# EAGLE design LowLevelv2 (EAGLE 8.0.2)

## Sheet 1 of 2
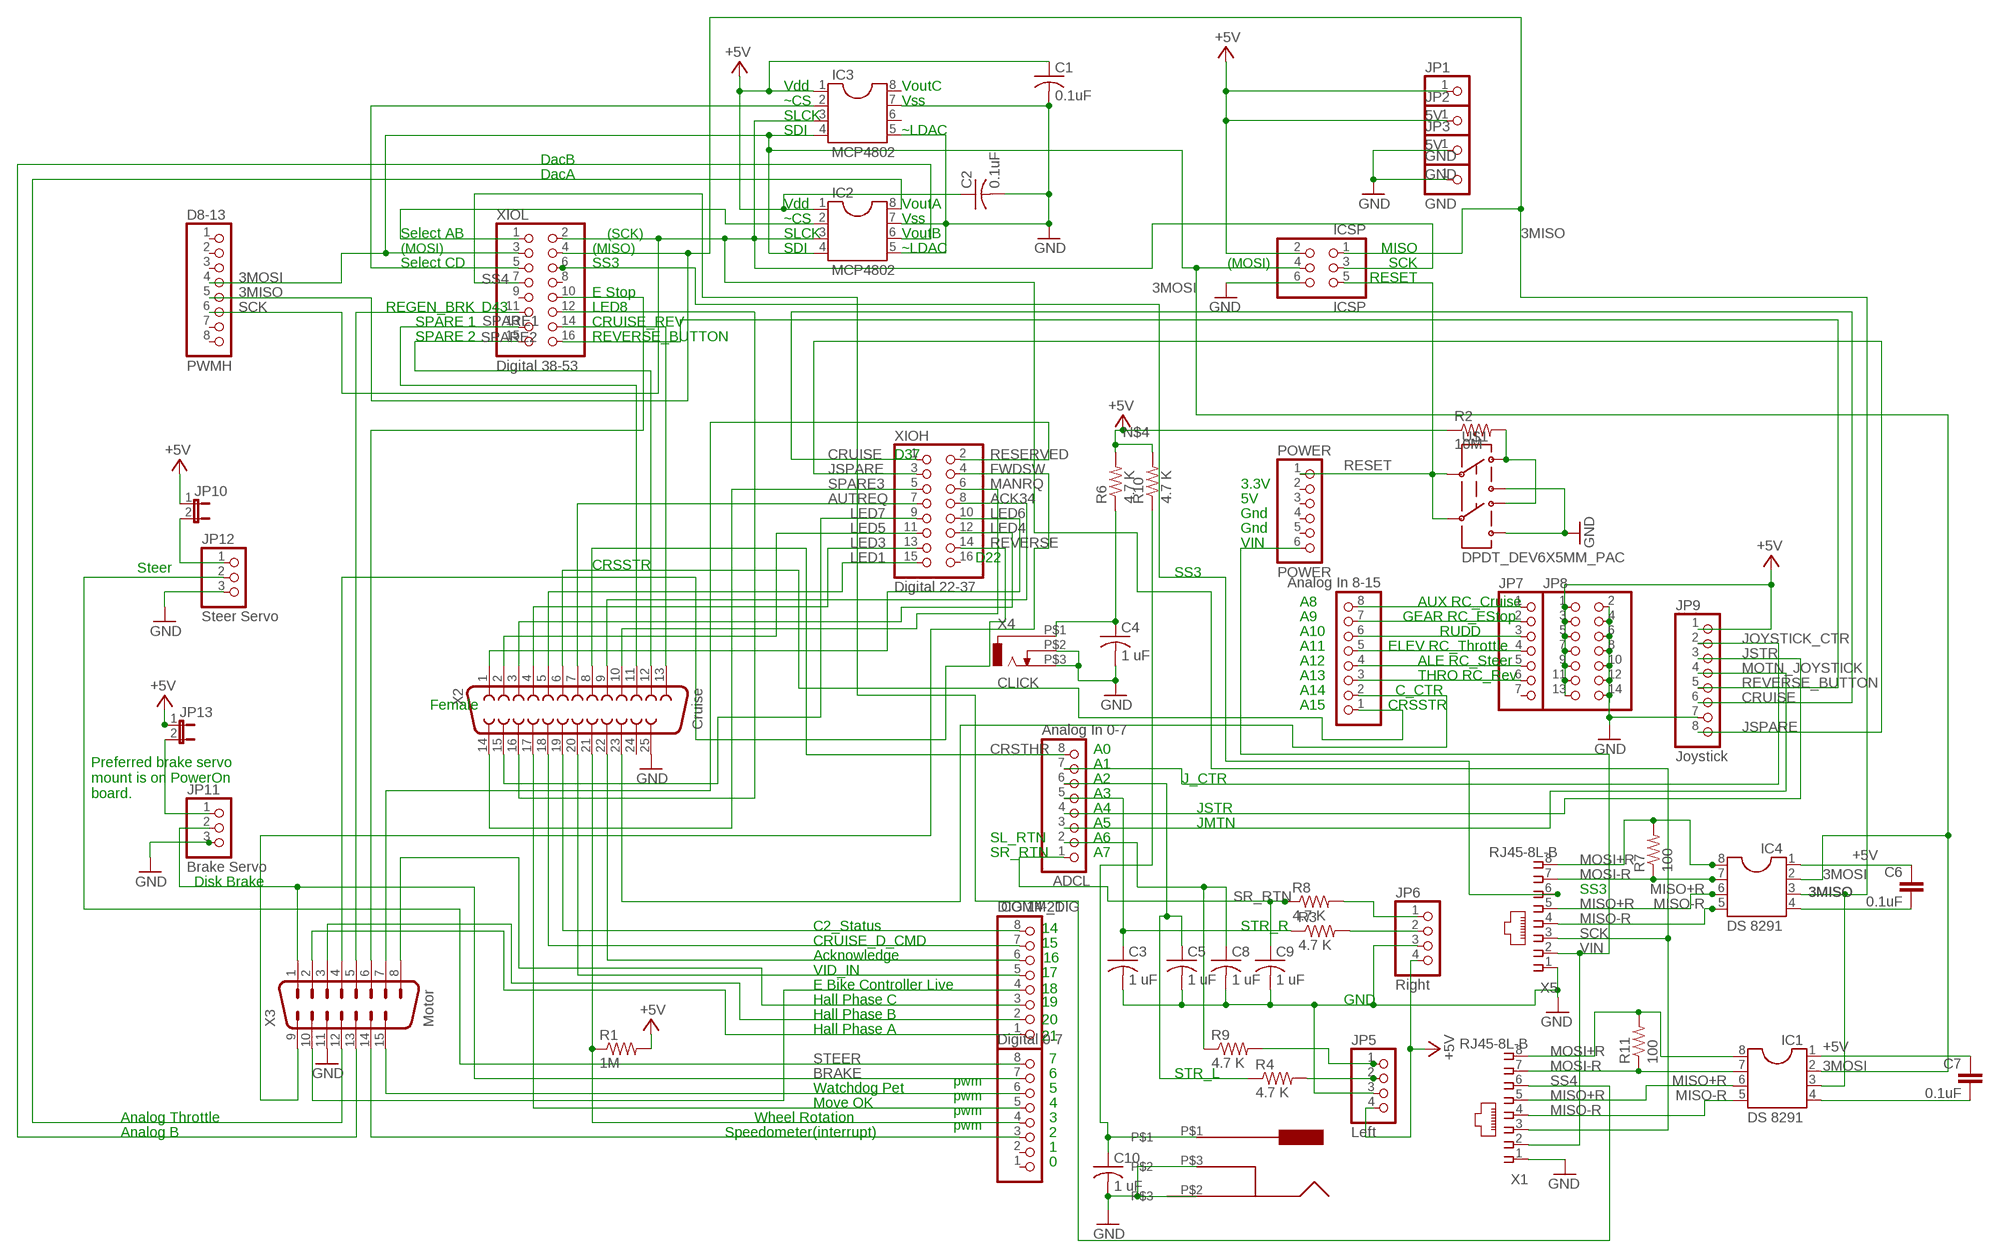
[diagram p0: schematic, sheet 1]

### Parts
ADCH  Analog In 8-15  PINHD-1X8  [1X08]
ADCL  Analog In 0-7  PINHD-1X8  [1X08]
C1  0.1uF  C-US025-025X050  [C025-025X050]
C2  0.1uF  C-US025-025X050  [C025-025X050]
C3  1 uF  C-US025-030X050  [C025-030X050]
C4  1 uF  C-US025-030X050  [C025-030X050]
C5  1 uF  C-US025-030X050  [C025-030X050]
C6  0.1uF  C2.5/2  [C2.5-2]
C7  0.1uF  C2.5/2  [C2.5-2]
C8  1 uF  C-US025-030X050  [C025-030X050]
C9  1 uF  C-US025-030X050  [C025-030X050]
C10  1 uF  C-US025-030X050  [C025-030X050]
COMM_DIG  DIG 14-21  PINHD-1X8  [1X08]
D8-13  PWMH  PINHD-1X8  [1X08]
GND  GND  PINHD-1X1  [1X01]
IC1  DS 8291  DIL8  [DIL08]
IC2  MCP4802  DIL8  [DIL08]
IC3  MCP4802  DIL8  [DIL08]
IC4  DS 8291  DIL8  [DIL08]
ICSP  ICSP  PINHD-2X3  [2X03]
JP1  5V  PINHD-1X1  [1X01]
JP2  5V  PINHD-1X1  [1X01]
JP3  GND  PINHD-1X1  [1X01]
JP5  Left  PINHD-1X4/90  [1X04/90]
JP6  Right  PINHD-1X4/90  [1X04/90]
JP7  PINHD-1X7  [1X07]
JP8  PINHD-2X7  [2X07]
JP9  Joystick  PINHD-1X8/90  [1X08/90]
JP10  JP1E  [JP1]
JP11  Brake Servo  PINHD-1X3/90  [1X03/90]
JP12  Steer Servo  PINHD-1X3/90  [1X03/90]
JP13  JP1E  [JP1]
POWER  POWER  PINHD-1X6  [1X06]
PWML  Digital 0-7  PINHD-1X8  [1X08]
R1  1M  R-US_0207/10  [0207/10]
R2  10M  R-US_0207/10  [0207/10]
R3  4.7 K  R-US_0207/10  [0207/10]
R4  4.7 K  R-US_0207/10  [0207/10]
R6  4.7 K  R-US_0207/10  [0207/10]
R7  100  R-US_0207/10  [0207/10]
R8  4.7 K  R-US_0207/10  [0207/10]
R9  4.7 K  R-US_0207/10  [0207/10]
R10  4.7 K  R-US_0207/10  [0207/10]
R11  100  R-US_0207/10  [0207/10]
U$1  DPDT_DEV6X5MM_PAC  [NEWSWITCH2_PAC]
U$2  CUI_JACKTHROUGH_HOLE  [CUIJACK]
X1  RJ45-8L-B  [RJ45-NO-SHIELD]
X2  Cruise  F25H  [F25H]
X3  Motor  M15-182  [182-015-MALE]
X4  CLICK  ODO_JACK  [ODO_JACK]
X5  RJ45-8L-B  [RJ45-NO-SHIELD]
XIOH  Digital 22-37  PINHD-2X8  [2X08]
XIOL  Digital 38-53  PINHD-2X8  [2X08]

### Nets
1C: ADCH.6 JP7.3
3A: ADCH.3 JP7.6
3MISO: D8-13.5 IC1.3 IC4.3 ICSP.1 XIOL.4
3MOSI: D8-13.4 IC1.2 IC2.4 IC3.4 IC4.2 ICSP.4 XIOL.3
5V: JP10.2 JP12.1
5VOLT: JP11.1 JP13.2
+5V: C1.1 C2.1 C6.1 IC2.1 IC3.1 IC4.1 ICSP.2 JP1.1 JP2.1 JP5.4 JP6.4 JP8.1 JP8.3 JP8.5 JP8.7 JP8.9 JP8.11 JP8.13 JP9.1 JP10.1 JP13.1 R1.2 R2.1 R6.2 R10.2
A14: ADCH.7 JP7.2
A15: ADCH.8 JP7.1
ACK34: X2.9 XIOH.8
ACKNOWLEDGE: COMM_DIG.6 X2.22
AUTREQ: X2.7 XIOH.7
BRAKE: JP11.2 PWML.7 X3.1
C2STATUS: COMM_DIG.8 X2.19
C_CTR: ADCH.2 X2.23
CRSSTR: ADCH.1 X2.6
CRSTHR: ADCL.8 X2.8
CRUISE: JP9.6 XIOH.1
CRUISE_D_CMD: COMM_DIG.7 X2.18
CRUISE_REV: X2.13 XIOL.14
DACA: IC2.8 X3.12
DACB: IC2.6 X3.13
EBIKECONTRL: COMM_DIG.4 X3.10
ESTOP: X3.6 XIOL.10
FWDSW: X3.9 XIOH.4
GND: C1.2 C2.2 C3.2 C4.2 C5.2 C8.2 C9.2 C10.2 GND.1 IC2.5 IC2.7 IC3.5 IC3.7 ICSP.6 JP3.1 JP5.3 JP6.3 JP8.2 JP8.4 JP8.6 JP8.8 JP8.10 JP8.12 JP8.14 JP9.7 JP11.3 JP12.3 U$1.PIN3 U$1.PIN6 U$2.P$2 U$2.P$3 X1.1 X2.25 X3.11 X4.P$2 X4.P$3 X5.1
HALLPHASEA: COMM_DIG.1 X3.2
HALLPHASEB: COMM_DIG.2 X3.3
HALLPHASEC: COMM_DIG.3 X3.8
JOYSTICK_CTR: ADCL.7 JP9.2
JSPARE: JP9.8 XIOH.3
JSTR: ADCL.4 JP9.3
L_STR: JP5.2 R4.2
LED1: X2.5 XIOH.15
LED3: X2.4 XIOH.13
LED4: X2.3 XIOH.12
LED5: X2.2 XIOH.11
LED6: X2.1 XIOH.10
LED7: X2.15 XIOH.9
LED8: X2.16 XIOL.12
MANRQ: X2.10 XIOH.6
MISO+R: IC1.6 IC4.6 X1.5 X5.5
MISO-R: IC1.5 IC4.5 X1.4 X5.4
MOSI+R: IC1.8 IC4.8 R7.2 R11.2 X1.8 X5.8
MOSI-R: IC1.7 IC4.7 R7.1 R11.1 X1.7 X5.7
MOTN_JOYSTICK: ADCL.3 JP9.4
MOVEOK: PWML.5 X2.17
N$1: C10.1 R10.1 U$2.P$1
N$2: C6.2 IC4.4
N$3: C7.2 IC1.4
N$4: C4.1 R6.1 X4.P$1
N$5: C7.1 IC1.1
N$6: R2.2 U$1.PIN1 U$1.PIN4
N$27: ADCH.4 JP7.5
N$28: ADCH.5 JP7.4
R_STR: JP6.2 R3.2
REGENBAKE: X3.5 XIOL.11
RESERVED: X3.7 XIOH.2
RESET: ICSP.5 POWER.1 U$1.PIN2 U$1.PIN5
REVERSE: X3.4 XIOH.14
REVERSE_BUTTON: JP9.5 XIOL.16
SCK: D8-13.6 IC2.3 IC3.3 ICSP.3 X1.3 X5.3 XIOL.2
SELECTAB: IC2.2 XIOL.1
SELECTCD: IC3.2 XIOL.5
SL_RET: JP5.1 R9.2
SL_RTN: ADCL.2 C8.1 R9.1
SPARE1: X2.11 XIOL.13
SPARE2: X2.12 XIOL.15
SPARE3: X2.14 XIOH.5
SPEEDOMETER: PWML.3 X3.14
SR_RET: JP6.1 R8.2
SR_RTN: ADCL.1 C9.1 R8.1
SS3: X5.6 XIOL.6
SS4: X1.6 XIOL.7
STEER: JP12.2 PWML.8
STR_L: ADCL.6 C5.1 R4.1
STR_R: ADCL.5 C3.1 R3.1
VIDIN: COMM_DIG.5 X2.20
VIN: POWER.6 X1.2 X5.2
WATCHDOG: PWML.6 X3.15
WHEELROTATION: PWML.4 R1.1 X2.21
Unconnected: D8-13.1 D8-13.2 D8-13.3 D8-13.7 D8-13.8 IC3.6 IC3.8 JP7.7 POWER.2 POWER.3 POWER.4 POWER.5 PWML.1 PWML.2 X2.24 XIOH.16 XIOL.8 XIOL.9

### Notes on the sheet
- Vdd | VoutC
- ~CS | Vss
- SLCK
- SDI | ~LDAC
- DacB
- DacA
- Vdd | VoutA
- ~CS | Vss
- Select AB | (SCK) | SLCK | VoutB
- (MOSI) | (MISO) | SDI | ~LDAC | MISO
- Select CD | SS3 | (MOSI) | SCK
- RESET
- E Stop
- REGEN_BRK | D43
- SPARE 1
- SPARE 2
- D37
- 3.3V
- 5V
- Gnd
- Gnd
- VIN
- Steer | D22
- CRSSTR
- SS3
- A8 | AUX RC_Cruise
- A9 | GEAR RC_EStop
- A10 | RUDD
- A11 | ELEV RC_Throttle
- A12 | ALE RC_Steer
- A13 | THRO RC_Rev
- A14 | C_CTR
- Female | A15 | CRSSTR
- A0
- A1
- A2 | J_CTR
- Preferred brake servo
  mount is on PowerOn
  board.
- A3
- A4 | JSTR
- A5 | JMTN
- SL_RTN | A6
- SR_RTN | A7
- Disk Brake
- SS3
- C2_Status | 14 | STR_R
- 15
- Acknowledge | 16
- VID_IN | 17
- E Bike Controller Live | 18
- Hall Phase C | 19 | GND
- Hall Phase B
- 20
- Hall Phase A
- 21
- 7
- 6 | STR_L
- pwm
- Watchdog Pet | 5
- pwm
- Move OK | 4
- pwm
- Analog Throttle | Wheel Rotation | 3
- pwm
- Analog B | Speedometer(interrupt) | 2
- 1
- 0

## Sheet 2 of 2

## Library data of the parts
ADCH ADCL COMM_DIG D8-13 JP9 PWML = pinhead:PINHD-1X8: PIN HEADER
C1-C5 C8-C10 = rcl:C-US: CAPACITOR, American symbol
C6 C7 = capacitor-wima:C: CAPACITOR naming: grid - package width
GND JP1-JP3 = pinhead:PINHD-1X1: PIN HEADER
IC1-IC4 = ic-package:DIL8: Dual In Line / Socket
ICSP = pinhead:PINHD-2X3: PIN HEADER
JP5 JP6 = pinhead:PINHD-1X4: PIN HEADER
JP7 = pinhead:PINHD-1X7: PIN HEADER
JP8 = pinhead:PINHD-2X7: PIN HEADER
JP10 JP13 = jumper:JP1E: JUMPER
JP11 JP12 = pinhead:PINHD-1X3: PIN HEADER
POWER = pinhead:PINHD-1X6: PIN HEADER
R1-R4 R6-R11 = rcl:R-US_: RESISTOR, American symbol
U$1 = elcanoParts:DPDT_DEV
U$2 = Elcano:CUI_JACK
X1 X5 = con-tycoelectronics:RJ45: CORCOM Modular RJ Jacks No Shield Source: www.tycoelectronics.com .. ENG_DS_1654001_1099_RJ_L_0507.pdf; MF: TYCO ELECTRONICS; MPN: RJ45-8L-B; OC_FARNELL: 1279843; OC_NEWARK: 52K4445
X2 = con-subd:F25: SUB-D; OC_FARNELL: unknown; OC_NEWARK: unknown
X3 = con-subd:M15: SUB-D; OC_FARNELL: unknown; OC_NEWARK: unknown
X4 = Elcano:ODO_JACK
XIOH XIOL = pinhead:PINHD-2X8: PIN HEADER

## Net classes
0 default: width 0.178 mm, drill 0.305 mm, clearance 0.178 mm
1 Power: width 0.508 mm, drill 0.305 mm, clearance 0.254 mm

## Board
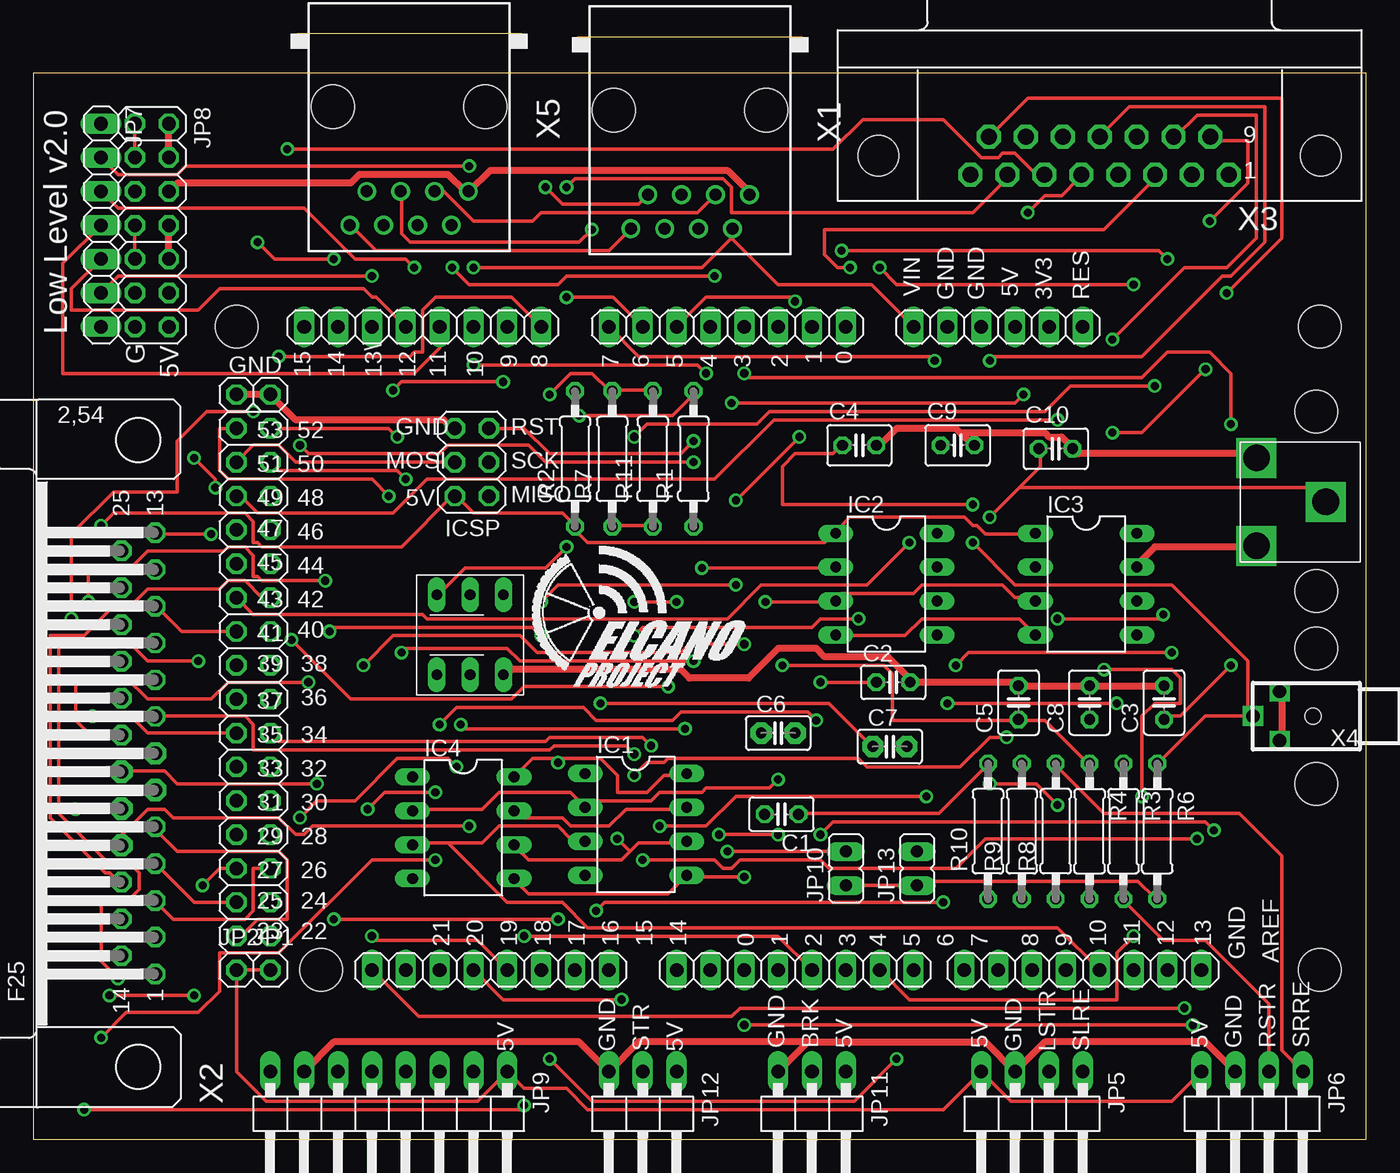
[diagram p1: board, top side]
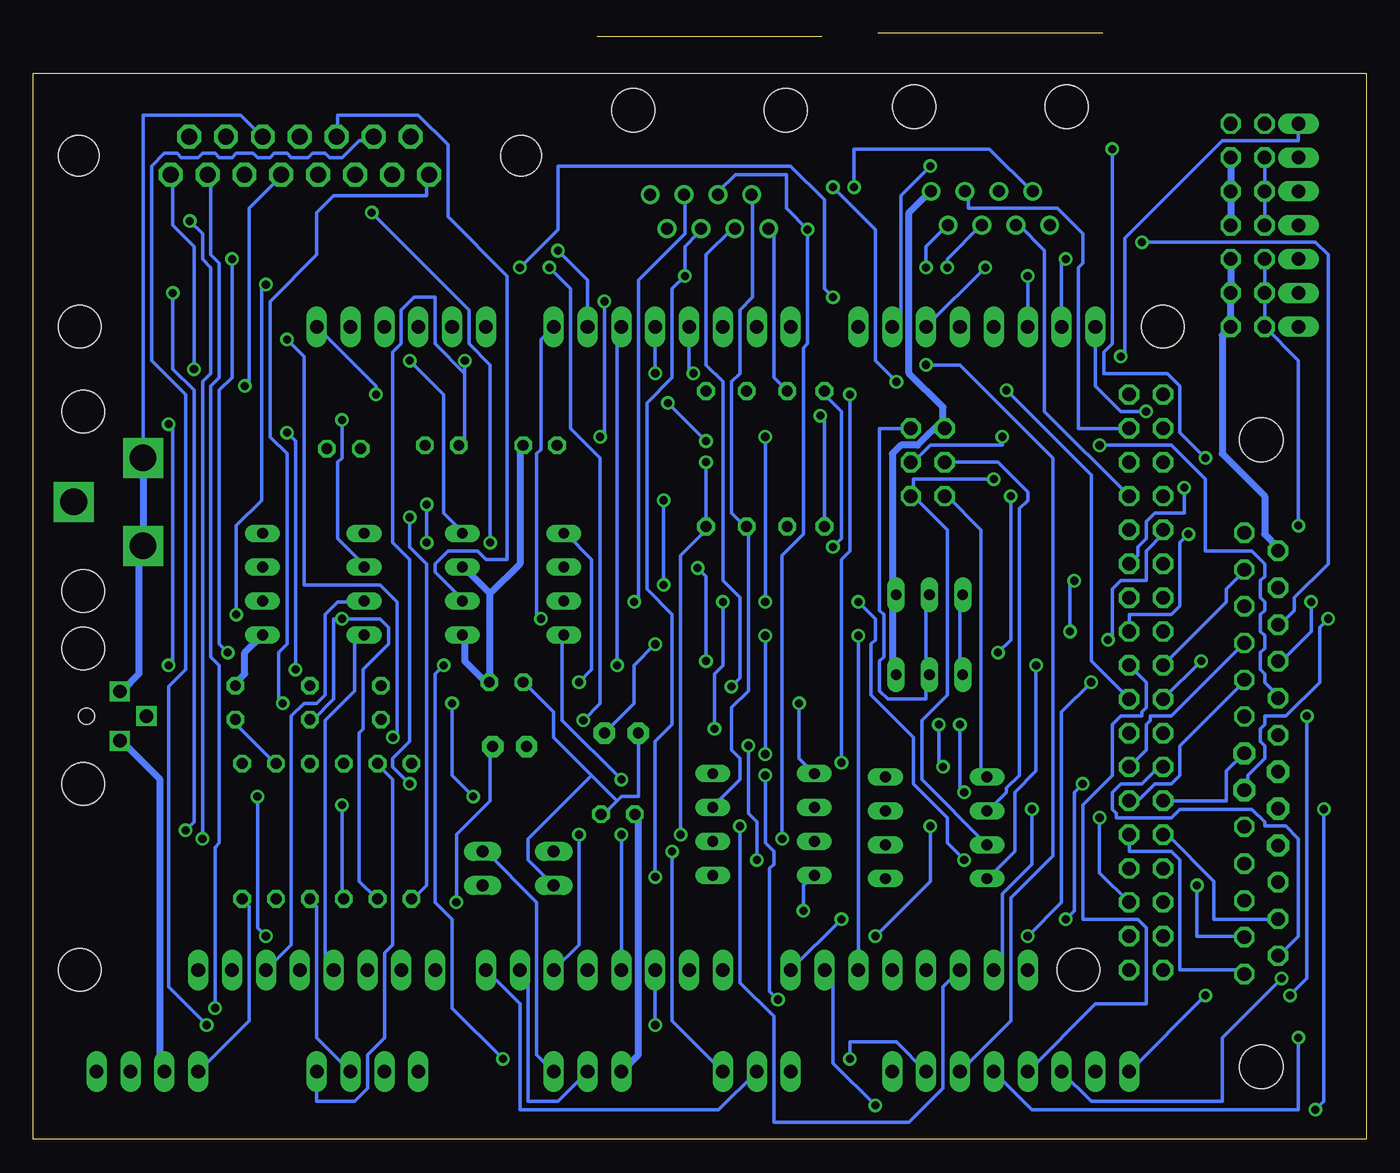
[diagram p2: board, bottom side, seen from below]

Size 100 x 80 mm. Coordinates in mm from the lower left corner, seen from the top.
Outline: 0,0 100,0 100,80 0,80 0,0
Copper layers (1*16): Top 0.035mm / dielectric 1.5mm / Bottom 0.035mm
Design rules "default": minimum track width 10mil, minimum drill 24mil, track to track 8mil, track to pad 8mil, pad to pad 8mil, via to via 8mil, smd to smd 8mil, copper to edge 40mil, drill to drill 8mil, minimum pad ring 10mil, minimum via ring 8mil, stop-mask expansion 4mil, vias tented up to drill 0mil, thermal gap 10mil
Holes 3.2 mm at 96.27,36.83 96.27,26.67 96.27,41.15 96.27,54.61 21.59,12.7 96.52,12.7 15.24,60.96 96.52,60.96

### Footprints (pad centres in the part's own frame; a part is rotated, then mirrored left to right if it is on the bottom)
1X08 = drill 1.016 long: 1 -8.89,0; 2 -6.35,0; 3 -3.81,0; 4 -1.27,0; 5 1.27,0; 6 3.81,0; 7 6.35,0; 8 8.89,0
C025-025X050 = drill 0.813 octagon: 1 -1.27,0; 2 1.27,0
C025-030X050 = drill 0.813 octagon: 1 -1.27,0; 2 1.27,0
C2.5-2 = drill 0.813 pad 1.6 octagon: 1 -1.27,0; 2 1.27,0
1X01 = drill 1.016 octagon: 1 0,0
DIL08 = drill 0.813 long: 1 -3.81,-3.81; 2 -1.27,-3.81; 3 1.27,-3.81; 4 3.81,-3.81; 5 3.81,3.81; 6 1.27,3.81; 7 -1.27,3.81; 8 -3.81,3.81
2X03 = drill 1.016 octagon: 1 -2.54,-1.27; 2 -2.54,1.27; 3 0,-1.27; 4 0,1.27; 5 2.54,-1.27; 6 2.54,1.27
1X04/90 = drill 1.016 long: 1 -3.81,-3.81; 2 -1.27,-3.81; 3 1.27,-3.81; 4 3.81,-3.81
1X07 = drill 1.016 long: 1 -7.62,0; 2 -5.08,0; 3 -2.54,0; 4 0,0; 5 2.54,0; 6 5.08,0; 7 7.62,0
2X07 = drill 1.016 octagon: 1 -7.62,-1.27; 2 -7.62,1.27; 3 -5.08,-1.27; 4 -5.08,1.27; 5 -2.54,-1.27; 6 -2.54,1.27; 7 0,-1.27; 8 0,1.27; 9 2.54,-1.27; 10 2.54,1.27; 11 5.08,-1.27; 12 5.08,1.27; 13 7.62,-1.27; 14 7.62,1.27
1X08/90 = drill 1.016 long: 1 -8.89,-3.81; 2 -6.35,-3.81; 3 -3.81,-3.81; 4 -1.27,-3.81; 5 1.27,-3.81; 6 3.81,-3.81; 7 6.35,-3.81; 8 8.89,-3.81
JP1 = drill 0.914 long: 1 0,-1.27; 2 0,1.27
1X03/90 = drill 1.016 long: 1 -2.54,-3.81; 2 0,-3.81; 3 2.54,-3.81
1X06 = drill 1.016 long: 1 -6.35,0; 2 -3.81,0; 3 -1.27,0; 4 1.27,0; 5 3.81,0; 6 6.35,0
0207/10 = drill 0.813 octagon: 1 -5.08,0; 2 5.08,0
NEWSWITCH2_PAC = drill 0.8 long: PIN1 -2.5,3; PIN2 0,3; PIN3 2.5,3; PIN4 -2.5,-3; PIN5 0,-3; PIN6 2.5,-3
CUIJACK = drill 2 pad 2.184 square: P$1 2.6,4.5; P$2 7.8,1.2; P$3 7.8,7.8
RJ45-NO-SHIELD = drill 0.9 pad 1.4: 1 -4.445,6.35; 2 -3.175,8.89; 3 -1.905,6.35; 4 -0.635,8.89; 5 0.635,6.35; 6 1.905,8.89; 7 3.175,6.35; 8 4.445,8.89 | hole 3.251: -5.715,0; 5.715,0
F25H = drill 1.016 octagon: 1 -16.561,-1.27; 2 -13.792,-1.27; 3 -11.049,-1.27; 4 -8.28,-1.27; 5 -5.512,-1.27; 8 2.769,-1.27; 9 5.512,-1.27; 10 8.28,-1.27; 11 11.049,-1.27; 12 13.792,-1.27; 13 16.561,-1.27; 14 -15.189,1.27; 15 -12.421,1.27; 16 -9.652,1.27; 20 1.372,1.27; 21 4.14,1.27; 22 6.909,1.27; 23 9.652,1.27; 24 12.421,1.27; 25 15.189,1.27 | drill 1.016 pad 1.67 octagon: 6 -2.769,-1.27; 7 0,-1.27; 17 -6.909,1.27; 18 -4.14,1.27; 19 -1.372,1.27 | hole 3.302: -23.52,0; 23.52,0
182-015-MALE = drill 1.194 pad 1.524 octagon: 1 -9.69,10.923; 2 -6.921,10.923; 3 -4.153,10.923; 4 -1.384,10.923; 5 1.384,10.923; 6 4.153,10.923; 7 6.921,10.923; 8 9.69,10.923; 9 -8.306,8.08; 10 -5.537,8.08; 11 -2.769,8.08; 12 0,8.08; 13 2.769,8.08; 14 5.537,8.08; 15 8.306,8.08 | hole 3.048: -16.599,9.501; 16.599,9.501
ODO_JACK = drill 1 square: P$1 4.5,0; P$2 2.5,1.85; P$3 2.5,-1.85 | hole 1.2: 0,0
2X08 = drill 1.016 octagon: 1 -8.89,-1.27; 2 -8.89,1.27; 3 -6.35,-1.27; 4 -6.35,1.27; 5 -3.81,-1.27; 6 -3.81,1.27; 7 -1.27,-1.27; 8 -1.27,1.27; 9 1.27,-1.27; 10 1.27,1.27; 11 3.81,-1.27; 12 3.81,1.27; 13 6.35,-1.27; 14 6.35,1.27; 15 8.89,-1.27; 16 8.89,1.27

### Placement (x,y rotation side)
ADCH  29.21,60.96 0 top
ADCL  52.07,60.96 0 top
C1  56.13,24.38 180 top
C2  64.52,34.29 0 top
C3  84.84,32.77 90 top
C4  61.98,52.07 0 top
C5  73.91,32.77 90 top
C6  55.88,30.48 0 top
C7  64.26,29.46 0 top
C8  79.25,32.77 90 top
C9  69.34,52.07 0 top
C10  76.71,51.82 0 top
COMM_DIG  34.29,12.7 0 top
D8-13  78.74,12.7 0 top
GND  15.24,55.88 0 top
IC1  45.21,23.62 270 top
IC2  64.01,41.66 270 top
IC3  78.99,41.66 270 top
IC4  32.26,23.37 270 top
ICSP  32.89,50.8 90 top
JP1  17.78,12.7 0 top
JP2  15.24,12.7 0 top
JP3  17.78,55.88 0 top
JP5  74.93,1.27 180 top
JP6  91.44,1.27 180 top
JP7  5.08,68.58 270 top
JP8  8.89,68.58 270 top
JP9  26.67,1.27 180 top
JP10  60.96,20.32 0 top
JP11  58.42,1.27 180 top
JP12  45.72,1.27 180 top
JP13  66.29,20.32 0 top
POWER  72.39,60.96 180 top
PWML  57.15,12.7 0 top
R1  49.53,51.05 90 top
R2  40.64,51.05 90 top
R3  81.79,23.11 270 top
R4  79.25,23.11 270 top
R6  84.33,23.11 270 top
R7  43.43,51.05 90 top
R8  76.71,23.11 90 top
R9  74.17,23.11 90 top
R10  71.63,23.11 90 top
R11  46.48,51.05 90 top
U$1  32.77,37.85 0 top
U$2  99.57,52.32 180 top
X1  49.28,77.22 180 top
X2  7.87,28.96 90 top
X3  80.01,83.31 180 top
X4  96.01,31.75 180 top
X5  28.19,77.47 180 top
XIOH  16.51,24.13 270 top
XIOL  16.51,44.45 270 top

### Tracks (layer width: path | path; a pad name or v marks a point on that pad's centre or on a via)
1C  (via drill 0.61)
  Top 0.254: v28.57,65.41 27.94,66.04 24.13,66.04 20.32,69.85 6.35,69.85 JP7.3
  Bottom 0.254: v28.57,65.41 ADCH.6
3A  (via drill 0.61)
  Top 0.254: JP7.6 6.35,64.77 v25.4,64.77
  Bottom 0.254: ADCH.3 v25.4,64.77
3MISO  (via drill 0.61)
  Top 0.254: 31.11,22.23 33.66,22.23 34.92,23.5 39.37,23.5 40.32,22.54 41.27,22.54 IC1.3 | 31.11,22.23 28.57,22.23 IC4.3 | D8-13.5 76.83,15.88 41.59,15.88 39.69,17.78 35.56,17.78 31.11,22.23 | XIOL.4 18.41,50.16 27.3,50.16 v27.94,49.53
  Bottom 0.254: 33.97,48.26 31.43,45.72 31.43,33.34 33.34,31.43 33.34,26.99 IC4.3 | v27.94,49.53 33.97,49.53 33.97,48.26 | 33.97,48.26 ICSP.1
3MOSI  (via drill 0.61)
  Top 0.254: IC3.4 73.98,39.05 66.67,39.05 65.41,37.78 60.33,37.78 IC2.4 | 40.96,25.4 41.27,25.08 IC1.2 40.96,25.4 | 40.96,25.4 40.32,26.04 34.92,26.04 33.66,24.77 28.57,24.77 IC4.2 | XIOL.3 16.51,52.07 18.41,52.07 19.68,50.8 ICSP.4 | v55.88,26.99 55.24,26.35 50.48,26.35 50.16,26.04 46.99,26.04 46.35,25.4 40.96,25.4
  Bottom 0.254: D8-13.4 78.11,13.34 78.11,31.43 75.88,33.66 75.88,37.15 IC3.4 | ICSP.4 27.62,50.8 25.4,48.58 25.4,47.94 26.04,47.31 26.04,27.3 26.99,26.35 26.99,26.04 28.26,24.77 IC4.2 | v55.88,26.99 60.33,31.43 60.33,37.78 IC2.4
5V  (via drill 0.61)
  Top 0.254: v52.07,21.59 JP10.2
  Bottom 0.254: v52.07,21.59 52.07,8.89 JP12.1
5VOLT
  Bottom 0.254: JP11.1 62.23,6.35 62.23,17.78 66.04,21.59 JP13.2
+5V  (via drill 0.61)
  Top 0.254: JP10.1 JP13.1 66.36,19.05 66.67,19.37 82.87,19.37 84.14,18.1 R6.2 | R10.2 71.44,27.94 67.94,24.45 57.47,24.45 C1.1 | JP1.1 JP2.1 15.24,5.08 17.46,2.86 33.34,2.86 JP9.1 36.83,3.81 40.01,3.81 41.59,2.22 68.26,2.22 JP5.4 73.34,2.86 85.41,2.86 JP6.4 | JP8.3 JP8.1 | JP8.7 JP8.9 | IC3.1 74.93,45.4 71.44,45.4 70.8,46.04 70.48,46.04 69.85,46.67 61.28,46.67 60.33,45.72 IC2.1 60.01,45.4 59.37,44.77 41.59,44.77 40.64,45.72 R2.1 40.64,46.04 39.69,46.99 33.02,46.99 31.75,48.26 ICSP.2 31.43,48.26 27.62,44.45 17.14,44.45 16.83,44.77 16.51,44.77 16.51,46.35 15.88,46.99 6.03,46.99 v5.08,46.04 | v40.96,54.29 47.94,54.29 49.53,55.88 R1.2 | v59.05,34.29 C2.1
  Bottom 0.254: 56.2,25.4 55.88,25.72 54.61,25.72 C6.1 | 56.2,25.4 57.15,24.45 C1.1 | 56.2,25.4 58.1,27.3 | 58.1,27.3 60.96,30.16 60.96,32.07 63.18,34.29 C2.1 | JP10.1 62.87,20.95 62.87,22.54 58.1,27.3 | JP6.4 83.82,8.89 83.82,17.46 84.14,17.78 R6.2 | JP8.3 JP8.5 JP8.7 | JP8.9 JP8.11 JP8.13 5.08,58.42 v5.08,46.04 | IC4.1 28.89,27.62 28.89,45.72 31.43,48.26 ICSP.2 | v40.96,54.29 40.64,53.98 R2.1 | v59.05,34.29 58.1,35.24 58.1,43.5 60.01,45.4 IC2.1
A14  (via drill 0.61)
  Top 0.254: v32.7,73.03 11.43,73.03 10.79,72.39 6.35,72.39 JP7.2
  Bottom 0.254: ADCH.7 34.92,61.59 34.92,70.8 v32.7,73.03
A15  (via drill 0.61)
  Top 0.254: ADCH.8 35.88,63.18 30.16,63.18 29.21,62.23 29.21,59.05 28.57,59.05 28.26,58.74 v18.41,58.74
  Bottom 0.254: v18.41,58.74 18.1,59.05 18.1,67.63 10.79,74.93 5.08,74.93 JP7.1
ACK34
  Bottom 0.254: XIOH.8 17.14,25.4 15.88,26.67 14.61,26.67 13.97,27.3 13.97,29.53 9.21,34.29 X2.9
ACKNOWLEDGE  (via drill 0.61)
  Top 0.254: v4.13,40.32 4.13,42.86 7.3,42.86 8.57,44.13 14.29,44.13 14.61,44.45 15.88,44.45 16.51,43.81 16.51,42.23 16.83,42.23 17.14,41.91 v21.91,41.91 | v22.23,38.1 22.54,38.42 37.47,38.42 v38.1,37.78
  Bottom 0.254: v4.13,40.32 4.13,38.1 6.35,35.88 X2.22 | v21.91,41.91 22.23,41.59 v22.23,38.1 | COMM_DIG.6 v38.1,37.78
AUTREQ
  Bottom 0.254: XIOH.7 10.48,25.4 10.48,27.62 X2.7
BRAKE  (via drill 0.61)
  Top 0.254: v87.95,57.78 83.19,53.02 v80.96,53.02 | v80.33,35.24 85.41,35.24 86.04,34.61 86.04,32.7 84.14,32.7 83.19,31.75 v83.19,25.72 | v82.55,15.24 81.28,13.97 81.28,10.48 65.72,10.48 PWML.7
  Bottom 0.254: JP11.2 60.64,2.86 62.87,2.86 62.87,12.06 PWML.7 | v87.95,57.78 87.95,66.99 89.53,68.58 89.53,72.07 X3.1 | v80.96,53.02 80.33,52.39 v80.33,35.24 | v83.19,25.72 83.19,15.88 v82.55,15.24
C2STATUS  (via drill 0.61)
  Top 0.254: v22.54,16.51 v39.37,16.51 | v21.27,26.67 10.79,26.67 9.84,27.62 6.67,27.62 X2.19
  Bottom 0.254: v39.37,16.51 COMM_DIG.8 | v22.54,16.51 21.91,17.14 21.91,26.04 v21.27,26.67
C_CTR  (via drill 0.61)
  Top 0.254: v16.83,67.31 18.1,66.04 v22.54,66.04
  Bottom 0.254: v16.83,67.31 3.81,67.31 2.86,66.36 2.86,43.18 5.4,40.64 5.4,39.69 6.35,38.73 X2.23 | v22.54,66.04 22.86,65.72 ADCH.2
CRSSTR  (via drill 0.61)
  Top 0.254: v16.51,54.61 13.02,54.61 10.79,52.39 10.79,48.58 6.03,48.58 2.86,45.4 v2.86,39.05
  Bottom 0.254: ADCH.1 20.32,56.52 18.41,54.61 v16.51,54.61 | v2.86,39.05 3.49,38.42 3.49,34.29 6.03,31.75 7.62,31.75 7.62,31.11 7.94,30.8 7.94,29.84 7.62,29.53 7.62,28.57 8.89,27.3 8.89,26.35 X2.6
CRSTHR  (via drill 0.61)
  Top 0.254: v45.09,28.89 44.45,29.53 39.05,29.53 38.73,29.21 16.51,29.21 16.51,31.11 15.88,31.75 9.21,31.75 X2.8 | v45.09,37.78 45.72,38.42 58.42,38.42 59.05,39.05 v61.91,39.05
  Bottom 0.254: v45.09,37.78 v45.09,28.89 | v61.91,39.05 62.23,39.37 62.23,51.44 61.91,51.75 61.91,60.01 ADCL.8
CRUISE  (via drill 0.61)
  Top 0.254: v6.35,12.06 5.08,13.34 5.08,17.78 6.99,17.78 7.94,18.73 7.94,20 7.3,20.64 5.71,20.64 1.91,24.45 1.91,37.15 7.3,37.15 8.57,35.88 v12.38,35.88
  Bottom 0.254: JP9.6 20.64,2.86 10.79,2.86 10.79,7.62 v6.35,12.06 | XIOH.1 v12.38,35.88
CRUISE_D_CMD  (via drill 0.61)
  Top 0.254: v36.83,2.54 36.51,2.22 v3.81,2.22 | v3.17,24.77 6.35,24.77 X2.18
  Bottom 0.254: COMM_DIG.7 40.01,12.06 40.01,5.71 v36.83,2.54 | v3.81,2.22 3.17,2.86 v3.17,24.77
CRUISE_REV  (via drill 0.61)
  Top 0.254: v13.34,45.4 9.21,45.4 X2.13
  Bottom 0.254: v13.34,45.4 13.97,44.77 13.97,40.01 14.61,39.37 17.78,39.37 XIOL.14
DACA  (via drill 0.61)
  Top 0.254: v71.75,58.42 72.07,58.74 83.19,58.74 89.22,64.77 89.85,64.77 92.39,67.31 92.39,77.47 82.23,77.47 80.01,75.25 X3.12
  Bottom 0.254: v71.75,58.42 69.22,55.88 69.22,46.99 67.94,45.72 IC2.8
DACB
  Bottom 0.254: IC2.6 67.94,40.64 69.85,42.55 69.85,43.18 68.9,44.13 66.67,44.13 66.04,43.5 64.45,43.5 64.45,64.77 68.9,69.22 68.9,74.61 71.12,76.83 77.15,76.83 77.15,75.25 X3.13
EBIKECONTRL  (via drill 0.61)
  Top 0.254: COMM_DIG.4 35.24,10.48 v44.13,10.48 | v45.09,27.3 46.04,28.26 47.31,28.26 47.62,28.57 61.91,28.57 62.55,27.94 69.53,27.94 71.75,30.16 v73.03,30.16 | v80.96,60.01 86.36,65.41 89.53,65.41 91.76,67.63 91.76,76.83 87.31,76.83 85.72,75.25 X3.10
  Bottom 0.254: v44.13,10.48 44.77,11.11 44.77,20.32 44.45,20.64 44.45,21.59 45.09,22.23 v45.09,27.3 | v73.03,30.16 72.71,30.48 72.71,40.32 73.98,41.59 79.69,41.59 79.69,58.74 v80.96,60.01
ESTOP  (via drill 0.61)
  Top 0.254: v13.65,48.9 13.65,49.53 v12.06,51.12 | v19.05,74.3 60.01,74.3 62.23,76.52 68.26,76.52 71.12,73.66 72.39,73.66 72.71,73.98 73.66,73.98 75.25,72.39 75.56,72.39 X3.6
  Bottom 0.254: XIOL.10 17.14,43.81 17.14,44.45 16.51,45.09 16.51,46.35 15.88,46.99 13.65,46.99 v13.65,48.9 | v12.06,51.12 13.97,53.02 13.97,56.52 14.92,57.47 19.68,57.47 19.68,59.05 19.05,59.69 v19.05,74.3
FWDSW  (via drill 0.61)
  Top 0.254: XIOH.4 18.41,29.84 38.42,29.84 38.73,30.16 45.72,30.16 v46.35,29.53 | v45.72,20.95 51.12,20.95 51.75,20.32 52.39,20.32 53.02,20.95 59.05,20.95 59.69,20.32 69.22,20.32 71.44,22.54 v87.31,22.54 | v88.27,68.9 91.12,71.75 91.12,74.93 88.58,74.93 X3.9
  Bottom 0.254: v46.35,29.53 46.35,24.45 45.72,23.81 v45.72,20.95 | v87.31,22.54 87.31,56.83 86.68,57.47 86.68,65.41 87.31,66.04 87.31,67.94 v88.27,68.9
GND
  Top 0.254: 91.76,44.45 U$2.P$3 | 78.11,51.75 C10.2 | 91.76,51.44 U$2.P$2
  Top 0.508: JP8.10 JP8.8 | JP8.4 JP8.2 | GND.1 JP3.1 19.68,53.98 30.8,53.98 31.43,53.34 ICSP.6 | X1.1 53.66,71.12 52.07,72.71 34.29,72.71 32.7,71.12 X5.1 32.38,71.12 31.11,72.39 24.45,72.39 23.81,71.75 10.79,71.75 JP8.6 | X4.P$2 93.66,30.16 93.66,33.34 X4.P$3 | 91.76,44.45 84.14,44.45 82.87,43.18 IC3.7 | C3.2 84.77,33.97 79.38,33.97 C8.2 79.06,33.97 73.98,33.97 C5.2 73.66,34.29 66.04,34.29 | 69.53,53.02 70.48,52.07 C9.2 | 69.53,53.02 69.22,53.34 64.77,53.34 63.5,52.07 C4.2 | 69.53,53.02 75.88,53.02 76.2,52.7 77.15,52.7 77.79,52.07 C10.2 | 78.11,51.75 78.42,51.44 91.76,51.44 | JP9.7 22.54,7.3 40.96,7.3 JP12.3 45.4,7.3 58.1,7.3 | JP6.3 87.95,7.3 75.88,7.3 JP5.3 71.44,7.3 58.1,7.3 | JP11.3 58.1,7.3 | 66.04,34.29 64.14,36.2 59.37,36.2 58.74,36.83 55.88,36.83 53.66,34.61 49.21,34.61 48.58,35.24 35.88,35.24 35.56,34.92 U$1.PIN6 | 66.04,34.29 C2.2
  Bottom 0.254: 32.7,71.12 X5.1 | X3.11 82.87,75.25 84.45,76.83 91.76,76.83 91.76,51.44 U$2.P$2 91.76,51.12
  Bottom 0.508: JP8.10 JP8.12 JP8.14 10.79,60.33 10.79,51.44 7.62,48.26 7.62,45.4 6.67,44.45 X2.25 | JP8.4 JP8.6 JP8.8 | U$1.PIN6 35.56,34.92 35.56,40.64 U$1.PIN3 35.56,40.96 35.56,51.44 34.92,52.07 33.66,52.07 31.75,53.98 | 32.7,71.12 34.29,69.53 34.29,57.47 31.75,54.93 31.75,53.98 | 31.75,53.98 31.75,53.34 ICSP.6 31.75,53.98 | X4.P$3 93.34,33.66 92.08,34.92 92.08,44.45 U$2.P$3 91.76,44.77 91.76,51.12 | IC2.5 67.63,37.78 67.63,35.88 66.04,34.29 C2.2 65.72,34.29 65.72,40.96 | 65.72,40.96 67.63,42.86 IC2.7 | IC3.5 84.14,36.51 84.14,34.92 84.77,34.29 C3.2 | 65.72,40.96 63.5,43.18 63.5,52.07 C4.2 | JP11.3 54.61,6.35 54.61,24.13 C1.2 | JP6.3 90.49,5.4 90.49,26.99 93.34,29.84 X4.P$2
HALLPHASEA  (via drill 0.61)
  Top 0.254: COMM_DIG.1 28.89,9.21 52.39,9.21 53.02,9.84 v86.36,9.84
  Bottom 0.254: v86.36,9.84 86.36,21.91 86.04,22.23 86.04,35.56 86.68,36.2 86.68,56.52 86.04,57.15 86.04,65.72 86.68,66.36 86.68,72.07 X3.2
HALLPHASEB  (via drill 0.61)
  Top 0.254: v25.08,24.77 26.35,26.04 v30.16,26.04 | v30.48,31.11 31.75,32.38 41.27,32.38 42.23,31.43 47.94,31.43 48.58,32.07 58.1,32.07 v58.74,31.43 | v61.28,65.41 60.33,65.41 59.37,66.36 59.37,68.26 80.33,68.26 84.14,72.07 X3.3
  Bottom 0.254: COMM_DIG.2 27.3,13.34 27.3,18.41 25.08,20.64 v25.08,24.77 | v30.16,26.04 30.48,26.35 v30.48,31.11 | v58.74,31.43 57.47,32.7 57.47,51.12 59.69,53.34 59.69,63.82 v61.28,65.41
HALLPHASEC  (via drill 0.61)
  Top 0.254: v46.99,23.5 50.48,23.5 52.7,25.72 v66.99,25.72 | v81.28,32.7 v68.58,32.7
  Bottom 0.254: COMM_DIG.3 31.75,11.43 31.75,3.81 34.29,1.27 44.45,1.27 44.45,9.21 46.99,11.75 v46.99,23.5 | v66.99,25.72 68.58,27.3 v68.58,32.7 | v81.28,32.7 81.6,33.02 81.6,36.51 80.96,37.15 80.96,51.44 82.23,52.7 82.23,62.87 78.74,66.36 78.74,69.53 77.47,70.8 70.48,70.8 70.48,72.07 X3.8
JOYSTICK_CTR  (via drill 0.61)
  Top 0.254: v38.73,6.03 41.91,2.86 61.59,2.86 v64.77,6.03 | v69.22,35.56 70.17,36.51 v85.41,36.51 | v85.09,66.04 84.45,66.67 v60.64,66.67
  Bottom 0.254: JP9.2 35.24,7.3 38.73,7.3 v38.73,6.03 | v64.77,6.03 68.58,9.84 68.58,16.51 69.85,17.78 69.85,34.92 v69.22,35.56 | v85.41,36.51 86.04,37.15 86.04,56.2 85.09,57.15 v85.09,66.04 | v60.64,66.67 58.42,64.45 ADCL.7
JSPARE  (via drill 0.61)
  Top 0.254: v5.71,10.79 v12.06,10.79 | v4.45,31.75 7.3,31.75 8.57,30.48 XIOH.3
  Bottom 0.254: v12.06,10.79 JP9.8 | v5.71,10.79 4.45,12.06 v4.45,31.75
JSTR  (via drill 0.61)
  Top 0.254: v33.02,58.1 49.85,58.1 v50.48,57.47
  Bottom 0.254: JP9.3 26.67,8.89 26.67,18.1 23.5,21.27 23.5,51.12 30.48,58.1 v33.02,58.1 | v50.48,57.47 50.8,57.78 ADCL.4
L_STR
  Bottom 0.254: JP5.2 78.74,7.62 78.74,17.46 79.06,17.78 R4.2
LED1
  Top 0.254: XIOH.15 15.56,15.24 16.83,16.51 19.05,16.51 19.05,20.95 18.41,21.59 10.79,21.59 9.21,23.18 X2.5
LED3
  Top 0.254: XIOH.13 12.06,17.78 9.21,20.64 X2.4
LED4
  Top 0.254: XIOH.12 16.51,20.32 16.51,17.14 15.88,16.51 10.48,16.51 9.21,17.78 X2.3
LED5  (via drill 0.61)
  Top 0.254: v12.7,19.05 13.97,20.32 XIOH.11
  Bottom 0.254: v12.7,19.05 12.7,15.24 9.21,15.24 X2.2
LED6
  Bottom 0.254: XIOH.10 17.78,21.59 14.61,21.59 13.97,20.95 13.97,12.7 9.21,12.7 X2.1
LED7
  Bottom 0.254: XIOH.9 14.92,22.86 11.43,19.37 11.43,16.51 6.67,16.51 X2.15
LED8
  Top 0.254: XIOL.12 17.14,40.64 15.88,41.91 14.61,41.91 13.97,41.27 8.57,41.27 7.3,40.01 6.03,40.01 3.81,37.78 1.27,37.78 1.27,24.13 5.4,20 5.71,20 6.35,19.37 X2.16
MANRQ
  Bottom 0.254: XIOH.6 16.51,29.21 16.51,31.11 16.19,31.43 16.19,31.75 14.61,31.75 9.21,37.15 X2.10
MISO+R  (via drill 0.61)
  Top 0.254: 44.77,21.59 45.4,22.23 48.9,22.23 IC1.6 | 44.77,21.59 44.13,20.95 37.15,20.95 36.2,21.91 IC4.6 | v41.91,68.26 40.96,67.31 28.26,67.31 27.62,67.94 27.62,71.12 X5.5 | v43.81,22.54 44.77,21.59
  Bottom 0.254: X1.5 48.58,71.12 47.31,72.39 43.5,72.39 43.5,69.85 v41.91,68.26 41.91,59.69 42.23,59.37 42.23,45.4 43.81,43.81 v43.81,22.54
MISO-R  (via drill 0.61)
  Top 0.254: IC4.5 36.2,19.37 37.15,18.41 47.62,18.41 IC1.5 49.21,19.68 v53.34,19.68 | v31.43,65.41 32.7,64.14 39.37,64.14 40.01,64.77 v51.12,64.77
  Bottom 0.254: v31.43,65.41 31.43,66.04 28.89,68.58 X5.4 | X1.4 50.16,68.26 50.16,67.94 51.12,66.99 v51.12,64.77 52.07,63.82 52.07,57.15 53.98,55.24 53.98,41.27 52.07,39.37 52.07,31.11 53.34,29.84 v53.34,19.68
MOSI+R  (via drill 0.61)
  Top 0.254: IC4.8 37.47,28.57 39.37,28.57 | 39.37,28.57 42.55,28.57 43.81,27.3 43.81,26.04 46.04,26.04 47.31,27.3 48.9,27.3 IC1.8 | R11.2 46.35,56.2 43.5,56.2 R7.2 43.18,56.2 41.91,57.47 40.32,57.47 v38.73,55.88 | X1.8 43.18,66.67 25.72,66.67 23.81,68.58 X5.8 | v39.37,28.26 39.37,28.57
  Bottom 0.254: X1.8 44.45,67.94 44.45,57.15 R7.2 | v39.37,28.26 39.37,43.5 38.73,44.13 v38.73,55.88
MOSI-R  (via drill 0.61)
  Top 0.254: IC4.7 36.2,24.45 36.51,24.13 39.69,24.13 40.32,23.5 43.18,23.5 44.45,24.77 48.9,24.77 IC1.7 | R7.1 43.5,46.04 46.35,46.04 R11.1 | v38.42,71.44 39.69,70.17 45.4,70.17 X1.7
  Bottom 0.254: X1.7 46.04,70.8 46.04,63.18 46.99,62.23 46.99,57.47 47.62,56.83 47.62,46.99 46.67,46.04 R11.1 46.35,45.72 46.35,33.66 47.62,32.38 47.62,29.21 46.99,28.57 46.99,26.99 48.9,25.08 IC1.7 | v38.42,71.44 38.42,74.3 28.26,74.3 25.08,71.12 X5.7
MOTN_JOYSTICK  (via drill 0.61)
  Top 0.254: v5.08,7.62 6.99,9.53 12.38,9.53 13.97,11.11 13.97,13.97 18.41,13.97 25.4,20.95 v30.16,20.95 | v38.1,40.32 39.37,41.59 v52.7,41.59 | v57.47,52.7 v52.7,47.94 | v57.15,62.87 56.83,63.18 50.48,63.18 ADCL.3
  Bottom 0.254: JP9.4 25.08,2.22 5.08,2.22 v5.08,7.62 | v30.16,20.95 31.43,22.23 31.43,24.13 33.97,26.67 33.97,30.16 37.15,33.34 37.15,37.15 36.83,37.47 36.83,39.05 v38.1,40.32 | v52.7,47.94 v52.7,41.59 | v57.47,52.7 57.15,53.02 v57.15,62.87
MOVEOK  (via drill 0.61)
  Top 0.254: PWML.5 55.88,15.24 v36.83,15.24 | v32.7,23.5 20.95,23.5 20.32,22.86 19.68,22.86 18.41,24.13 10.48,24.13 9.84,24.77 8.57,24.77 6.67,22.86 6.67,22.23 X2.17
  Bottom 0.254: v36.83,15.24 32.7,19.37 v32.7,23.5
N$1  (via drill 0.61)
  Top 0.254: 73.98,48.9 75.56,50.48 75.56,51.75 C10.1 | 73.98,48.9 v71.75,46.67 | 73.98,48.9 95.89,48.9 96.84,47.94 U$2.P$1
  Bottom 0.254: v71.75,46.67 71.75,44.45 70.48,43.18 70.48,19.05 71.44,18.1 R10.1
N$2  (via drill 0.61)
  Top 0.254: v24.77,35.56 26.99,37.78 36.51,37.78 37.78,36.51 48.58,36.51 49.21,37.15 v53.34,37.15
  Bottom 0.254: v24.77,35.56 24.77,27.62 26.35,26.04 26.35,21.59 28.26,19.68 IC4.4 | v53.34,37.15 54.93,35.56 54.93,32.7 C6.2
N$3  (via drill 0.61)
  Top 0.254: v42.23,17.14 42.86,17.78 v68.26,17.78
  Bottom 0.254: v42.23,17.14 42.23,19.05 41.59,19.68 IC1.4 | v68.26,17.78 68.26,22.86 65.72,25.4 65.72,29.21 C7.2
N$4  (via drill 0.61)
  Top 0.254: X4.P$1 91.12,31.75 | 91.12,31.75 87.95,31.75 84.45,28.26 R6.1 | v70.48,47.62 56.2,47.62 56.2,50.48 57.15,51.44 60.01,51.44 60.64,52.07 C4.1 | v70.48,44.77 73.66,41.59 85.41,41.59 91.12,35.88 91.12,31.75
  Bottom 0.254: v70.48,44.77 v70.48,47.62
N$5  (via drill 0.61)
  Top 0.254: v42.55,32.7 59.69,32.7 62.87,29.53 C7.1
  Bottom 0.254: IC1.1 42.55,28.57 v42.55,32.7
N$6  (via drill 0.61)
  Top 0.254: v40.01,44.45 38.42,42.86 32.38,42.86 30.48,40.96 U$1.PIN1
  Bottom 0.254: U$1.PIN4 30.48,34.92 30.48,40.64 U$1.PIN1 | v40.01,44.45 39.37,45.09 39.37,54.61 40.64,55.88 R2.2
N$27
  Top 0.254: JP7.5 2.86,63.82 2.86,62.23 12.38,62.23 13.97,63.82 24.77,63.82 25.4,63.18 25.72,63.18 ADCH.4
N$28
  Top 0.254: JP7.4 2.22,65.72 2.22,57.47 28.57,57.47 30.48,59.37 ADCH.5
R_STR
  Top 0.254: JP6.2 92.71,10.16 87.95,14.92 84.77,14.92 81.92,17.78 R3.2
REGENBAKE  (via drill 0.61)
  Top 0.254: XIOL.11 16.51,39.37 29.21,39.37 29.53,39.05 52.07,39.05 54.61,41.59 62.55,41.59 v65.72,44.77 | v74.61,69.53 75.88,70.8 77.15,70.8 78.42,72.07 X3.5
  Bottom 0.254: v65.72,44.77 65.72,58.1 67.31,59.69 67.31,62.23 v74.61,69.53
RESERVED  (via drill 0.61)
  Top 0.254: v26.99,56.2 27.62,56.83 v35.24,56.83 | v40.01,71.44 40.64,72.07 51.75,72.07 52.39,71.44 52.39,69.53 70.48,69.53 73.03,72.07 X3.7
  Bottom 0.254: XIOH.2 20.64,35.88 20.64,49.85 v26.99,56.2 | v35.24,56.83 36.83,58.42 36.83,68.26 v40.01,71.44
RESET  (via drill 0.61)
  Top 0.254: v74.3,55.88 73.66,55.24 v52.39,55.24 | v49.53,52.39 48.58,51.44 38.73,51.44 36.83,53.34 ICSP.5
  Bottom 0.254: U$1.PIN2 33.02,40.64 33.02,34.92 U$1.PIN5 33.02,34.61 33.02,33.02 35.88,33.02 36.51,33.66 36.51,35.88 36.2,36.2 36.2,39.37 36.51,39.69 36.51,53.34 ICSP.5 | POWER.1 74.3,56.52 v74.3,55.88 | v49.53,52.39 v52.39,55.24
REVERSE  (via drill 0.61)
  Top 0.254: v20,24.13 21.27,25.4 24.13,25.4 27.3,28.57 31.11,28.57 v31.75,27.94 | v32.07,31.11 32.38,30.8 v48.9,30.8 | v45.09,40.32 v48.26,40.32 | v45.09,52.7 46.04,53.66 54.29,53.66 55.24,54.61 75.88,54.61 77.79,56.52 v84.14,56.52
  Bottom 0.254: XIOH.14 20,20 v20,24.13 | v31.75,27.94 32.07,28.26 v32.07,31.11 | v48.9,30.8 48.9,34.92 48.26,35.56 v48.26,40.32 | v45.09,52.7 v45.09,40.32 | v84.14,56.52 83.82,56.83 83.82,69.85 81.6,72.07 X3.4
REVERSE_BUTTON
  Bottom 0.254: JP9.5 20.32,10.16 16.51,10.16 16.51,15.88 17.14,16.51 21.27,16.51 21.27,25.08 19.05,27.3 19.05,31.11 18.41,31.75 16.83,31.75 16.83,32.07 16.51,32.38 16.51,34.29 XIOL.16
SCK  (via drill 0.61)
  Top 0.254: IC3.3 74.93,40.64 73.66,40.64 72.71,41.59 66.67,41.59 66.04,40.96 60.64,40.96 60.33,40.64 IC2.3 60.01,40.32 v54.93,40.32 | X1.3 49.85,69.53 38.1,69.53 37.47,68.9 33.02,68.9 30.8,71.12 X5.3 | v27.3,52.7 26.67,53.34 XIOL.2
  Bottom 0.254: D8-13.6 80.64,14.61 80.64,31.75 79.69,32.7 78.74,32.7 78.11,33.34 78.11,39.37 77.15,40.32 75.25,40.32 IC3.3 | XIOL.2 21.59,53.34 21.59,65.41 21.27,65.72 21.27,67.94 23.18,69.85 29.84,69.85 29.84,71.12 X5.3 | v27.3,52.7 27.3,52.07 32.7,52.07 33.97,50.8 ICSP.3 | v54.93,40.32 54.61,40.64 54.61,64.45 51.12,67.94 51.12,70.8 X1.3
SELECTAB  (via drill 0.61)
  Top 0.254: v50.16,42.86 60.01,42.86 IC2.2 | v49.53,35.88 36.51,35.88 35.56,36.83 27.94,36.83 v27.62,36.51 | v26.67,48.26 25.4,49.53 14.61,49.53 13.97,50.16 13.97,53.34 XIOL.1
  Bottom 0.254: v50.16,42.86 49.53,42.23 v49.53,35.88 | v27.62,36.51 26.67,37.47 v26.67,48.26
SELECTCD  (via drill 0.61)
  Top 0.254: v76.83,53.98 55.56,53.98 51.12,49.53 29.53,49.53 26.99,46.99 16.83,46.99 15.56,48.26 XIOL.5
  Bottom 0.254: v76.83,53.98 76.83,51.12 77.15,50.8 77.15,45.09 75.25,43.18 IC3.2
SL_RET
  Bottom 0.254: JP5.1 78.74,2.86 75.88,2.86 74.93,3.81 74.93,6.35 73.66,7.62 73.66,13.97 73.03,14.61 73.03,26.99 73.98,27.94 R9.2
SL_RTN  (via drill 0.61)
  Top 0.254: ADCL.2 43.5,63.18 v40.01,63.18 | v63.5,65.41 64.77,64.14 v82.55,64.14 | v84.77,39.37 84.45,39.05 v76.83,39.05
  Bottom 0.254: R9.1 74.3,18.1 75.56,19.37 75.56,30.48 75.25,30.8 75.25,35.24 73.34,37.15 73.34,38.42 73.98,39.05 v76.83,39.05 77.47,39.05 77.47,33.02 79.06,31.43 C8.1 | v40.01,63.18 40.64,63.82 40.64,70.48 43.18,73.03 60.64,73.03 60.64,68.26 v63.5,65.41 | v82.55,64.14 82.87,63.82 82.87,47.94 84.77,46.04 v84.77,39.37
SPARE1
  Top 0.254: XIOL.13 11.11,38.1 9.21,40.01 X2.11
SPARE2
  Bottom 0.254: XIOL.15 10.48,40.32 10.48,41.27 9.21,42.55 X2.12
SPARE3
  Bottom 0.254: XIOH.5 15.56,27.94 16.83,26.67 18.41,26.67 19.05,26.04 19.05,24.77 18.73,24.45 18.73,24.13 14.61,24.13 13.97,24.77 8.57,24.77 7.62,23.81 7.62,23.5 6.03,23.5 5.08,22.54 5.08,15.24 6.35,13.97 X2.14
SPEEDOMETER  (via drill 0.61)
  Top 0.254: v87,8.57 v53.34,8.57
  Bottom 0.254: v53.34,8.57 PWML.3 | v87,8.57 89.85,11.43 89.85,33.97 88.58,35.24 88.58,55.88 91.12,58.42 91.12,73.03 90.17,73.98 89.22,73.98 88.9,73.66 87.63,73.66 87.31,73.98 86.36,73.98 86.04,73.66 85.09,73.66 84.77,73.98 83.5,73.98 83.19,73.66 82.23,73.66 81.92,73.98 80.96,73.98 80.64,73.66 79.38,73.66 79.06,73.98 78.11,73.98 77.79,73.66 76.83,73.66 75.56,74.93 74.61,74.93 X3.14
SR_RET
  Top 0.254: JP6.1 93.66,6.67 93.66,21.27 90.49,24.45 80.33,24.45 76.83,27.94 R8.2
SR_RTN  (via drill 0.61)
  Top 0.254: v67.63,58.42 67.31,58.74 45.4,58.74 ADCL.1 | v76.83,25.08 75.25,26.67 v71.75,26.67
  Bottom 0.254: v67.63,58.42 67.63,57.47 | 67.63,57.47 67.63,52.39 67.94,52.07 C9.1 | v76.83,25.08 76.83,18.1 R8.1 | v71.75,26.67 73.03,27.94 73.03,28.57 71.75,29.84 71.75,43.5 73.03,44.77 73.03,59.05 72.39,59.69 72.39,62.23 71.44,63.18 69.85,63.18 69.85,59.69 67.63,57.47
SS3
  Bottom 0.254: XIOL.6 24.13,54.61 24.13,66.67 26.04,68.58 X5.6
SS4  (via drill 0.61)
  Top 0.254: v47.62,33.97 36.83,33.97 35.88,33.02 23.81,33.02 v19.37,37.47
  Bottom 0.254: v47.62,33.97 46.99,34.61 46.99,40.64 48.26,41.91 48.26,56.83 49.53,58.1 49.53,66.36 47.62,68.26 X1.6 | v19.37,37.47 19.05,37.78 19.05,41.27 18.41,41.91 16.51,41.91 16.51,44.13 15.24,45.4 XIOL.7
STEER
  Bottom 0.254: JP12.2 48.58,2.22 63.5,2.22 63.5,10.16 PWML.8
STR_L  (via drill 0.61)
  Top 0.254: R4.1 79.06,28.26 75.88,31.43 73.98,31.43 C5.1 73.66,31.43 64.45,31.43 64.45,34.92 63.82,35.56 v56.2,35.56
  Bottom 0.254: ADCL.6 56.2,60.64 v56.2,35.56
STR_R  (via drill 0.61)
  Top 0.254: v53.34,57.47 53.66,57.15 83.19,57.15 85.09,59.05 88.27,59.05 89.85,57.47 v89.85,53.66 | v89.85,35.56 86.04,31.75 85.09,31.75 C3.1
  Bottom 0.254: R3.1 81.92,28.26 84.77,31.11 84.77,31.43 C3.1 | v53.34,57.47 ADCL.5 | v89.85,53.66 89.53,53.34 89.53,35.88 v89.85,35.56
VIDIN  (via drill 0.61)
  Top 0.254: v20.64,34.29 14.61,34.29 13.34,33.02 8.57,33.02 6.99,34.61 3.17,34.61 3.17,31.43 4.13,30.48 6.35,30.48 X2.20 | v25.4,15.24 25.72,14.92 33.34,14.92 COMM_DIG.5
  Bottom 0.254: v20.64,34.29 22.86,32.07 22.86,17.78 v25.4,15.24
VIN  (via drill 0.61)
  Top 0.254: v33.02,65.41 50.16,65.41 52.39,67.63 | 52.39,67.63 52.39,68.26 X1.2 52.39,67.63 | POWER.6 62.87,64.14 55.88,64.14 52.39,67.63
  Bottom 0.254: v33.02,65.41 33.02,66.99 31.43,68.58 X5.2
WATCHDOG  (via drill 0.61)
  Top 0.254: v59.05,22.86 60.01,23.81 87.95,23.81 v88.58,23.18 | v89.53,63.5 93.66,67.63 93.66,78.11 74.61,78.11 71.75,75.25 X3.15
  Bottom 0.254: PWML.6 59.05,14.61 v59.05,22.86 | v88.58,23.18 87.95,23.81 87.95,56.2 89.53,57.78 v89.53,63.5
WHEELROTATION  (via drill 0.61)
  Top 0.254: v55.88,22.86 v51.44,22.86 | v20,52.07 20.64,51.44 30.48,51.44 31.11,52.07 37.15,52.07 38.42,50.8 v49.53,50.8
  Bottom 0.254: v51.44,22.86 51.44,43.81 49.53,45.72 R1.1 v49.53,50.8 | PWML.4 v55.88,22.86 | v20,52.07 14.61,52.07 12.06,49.53 12.06,44.13 8.57,44.13 7.62,43.18 7.62,42.23 7.94,41.91 7.94,40.64 7.62,40.32 7.62,39.69 7.94,39.37 7.94,38.1 7.62,37.78 7.62,36.83 7.94,36.51 7.94,35.24 7.62,34.92 7.62,34.29 6.67,33.34 X2.21

### Text on the board
tNames: VIN | GND | GND | 5V | 3V3 | RES | G | 9 | 8 | 7 | 6 | 5 | 4 | 3 | 2 | 1 | 0 | 5V | 15 | 14 | 13\ | 12 | 11 | 10 | 53 | 52 | GND | RST | 51 | 50 | MOSI | SCK | MISO | 49 | 48 | 5V | 47 | 46 | 45 | 44 | 43 | 42 | 40 | 41 | 39 | 38 | 36 | 37 | 35 | 34 | 33 | 32 | 31 | 30 | 29 | 28 | 27 | 26 | GND | AREF | 25 | 24 | 23 | 22 | 21 | 20 | 19 | 18 | 17 | 16 | 15 | 14 | 0 | 1 | 2 | 3 | 4 | 5 | 6 | 7 | 8 | 9 | 10 | 11 | 12 | 13 | 5V | GND | STR | 5V | GND | BRK | 5V | 5V | GND | LSTR | SLRE | 5V | GND | RSTR | SRRE
tSilk: Low Level v2.0